# Altium schematic sheet ST-link V2.SchDoc
size A4; SheetNumber: 3; SheetTotal: 6
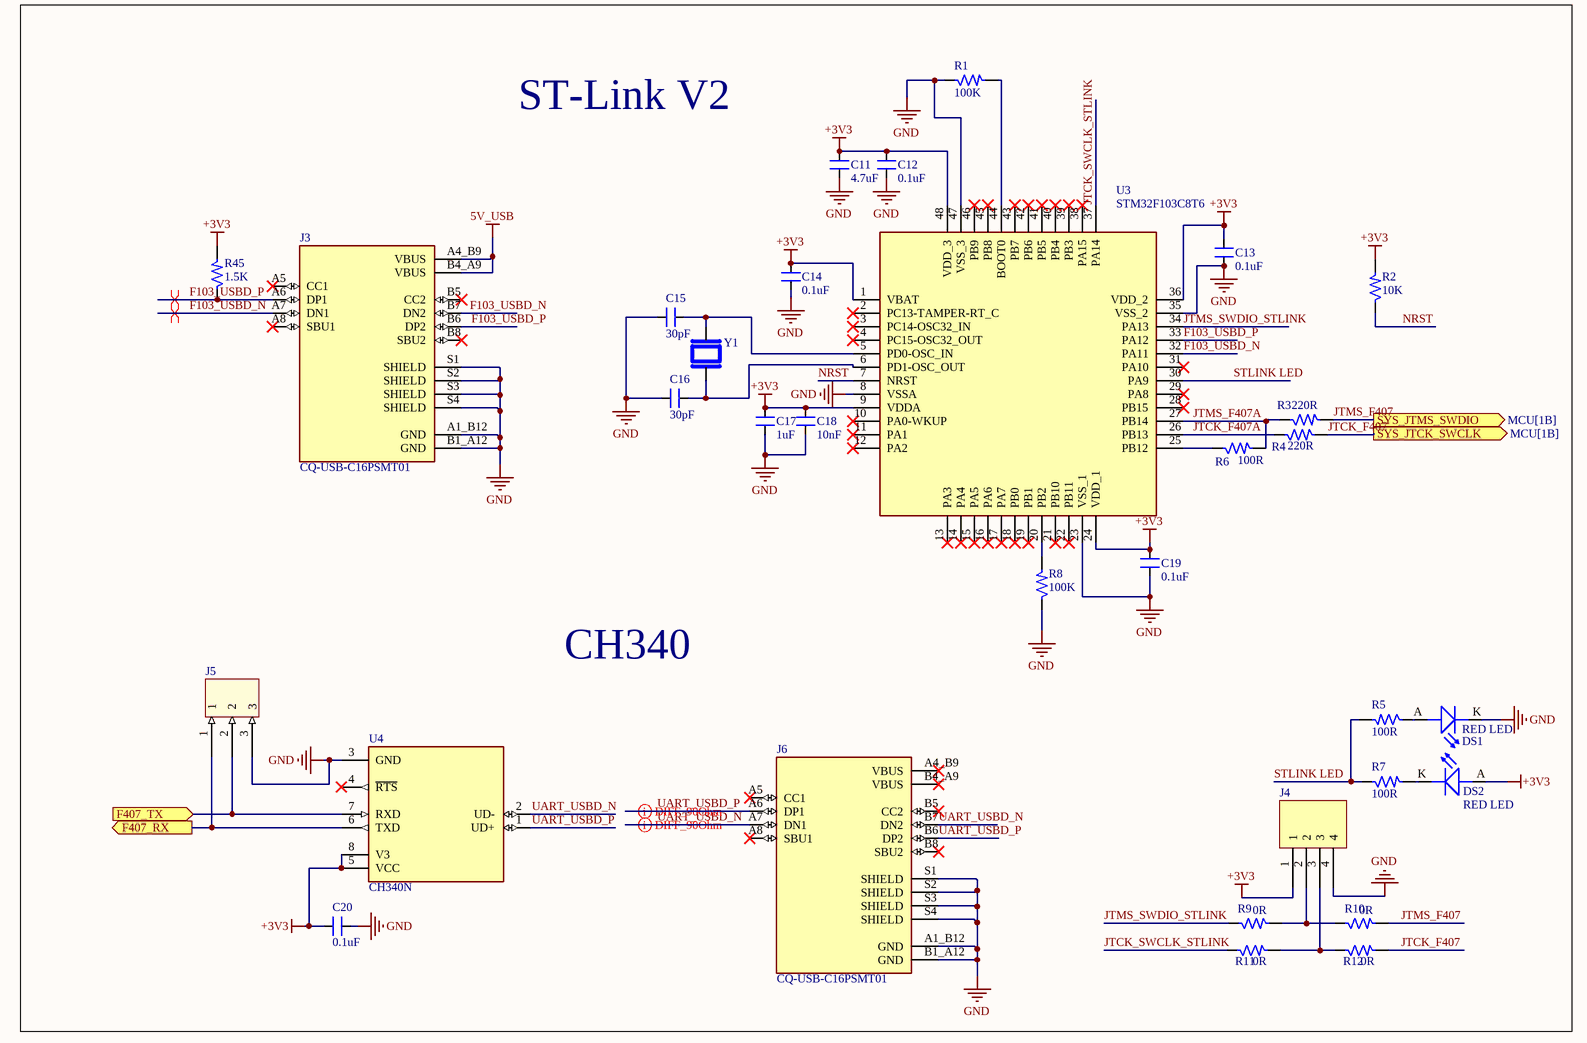
[diagram p0: ST-link V2.SchDoc]

## Parts
C11  4.7uF  [CAP_0805]
C12  0.1uF  [CAP_0805]
C13  0.1uF  [CAP_0805]
C14  0.1uF  [CAP_0805]
C15  30pF  [CAP_0805]
C16  30pF  [CAP_0805]
C17  1uF  [CAP_0805]
C18  10nF  [CAP_0805]
C19  0.1uF  [CAP_0805]
C20  0.1uF  [CAP_0805]
DS1  RED LED  [LED_0805]
DS2  RED LED  [LED_0805]
J3  CQ-USB-C16PSMT01  [SHENZHEN-CHUANGQIN-TECHNOLOGY_CQ-USB-C16PSMT01]
J4  4X1 BERG STRIP  [CON4_100_40D72_TH_ST_MALE]  (value not drawn)
J5  3X1 BERG STRIP  [CON3_100_40D72_TH_ST-MALE]  (value not drawn)
J6  CQ-USB-C16PSMT01  [SHENZHEN-CHUANGQIN-TECHNOLOGY_CQ-USB-C16PSMT01]
R1  100K  [RES_0603]
R2  10K  [RES_0603]
R3  220R  [RES_0805]
R4  220R  [RES_0805]
R5  100R  [RES_0805]
R6  100R  [RES_0805]
R7  100R  [RES_0805]
R8  100K  [RES_0603]
R9  0R  [RES_0805]
R10  0R  [RES_0805]
R11  0R  [RES_0805]
R12  0R  [RES_0805]
R45  1.5K  [RES_0805]
U3  STM32F103C8T6  [LQFP-48_19.6_393_58X11_SMD]
U4  CH340N  [SOIC127P600X160-8N]
Y1  ATS08A-E  [XTAL_HC49P488W43L1085T450H368]  (value not drawn)

## Ports
F407_RX (out, see MCU[1A]), F407_TX (in, see MCU[1A]), SYS_JTCK_SWCLK (out, see MCU[1B]), SYS_JTMS_SWDIO (out, see MCU[1B])

## Nets
5V_USB: J3.A4_B9(VBUS) J3.B4_A9(VBUS)
+3V3: C11.2 C12.2 C13.2 C14.2 C17.2 C18.2 C19.2 C20.2 DS2.A(ANODE) J4.1 R2.2 R45.2 U3.1(VBAT) U3.9(VDDA) U3.24(VDD_1) U3.36(VDD_2) U3.48(VDD_3) U4.5(VCC) U4.8(V3)
GND: C11.1 C12.1 C13.1 C14.1 C15.1 C16.1 C17.1 C18.1 C19.1 C20.1 DS1.K(CATHODE) J3.A1_B12(GND) J3.B1_A12(GND) J3.S1(SHIELD) J3.S2(SHIELD) J3.S3(SHIELD) J3.S4(SHIELD) J4.4 J5.3 J6.A1_B12(GND) J6.B1_A12(GND) J6.S1(SHIELD) J6.S2(SHIELD) J6.S3(SHIELD) J6.S4(SHIELD) R1.1 R8.1 U3.8(VSSA) U3.23(VSS_1) U3.35(VSS_2) U3.47(VSS_3) U4.3(GND)
F103_USBD_N: J3.A7(DN1) J3.B7(DN2) U3.32(PA11)
F103_USBD_P: J3.A6(DP1) J3.B6(DP2) R45.1 U3.33(PA12)
F407_RX: J5.1 U4.6(TXD) ; port F407_RX
F407_TX: J5.2 U4.7(RXD) ; port F407_TX
JTCK_F407: R4.2 R12.2 ; port SYS_JTCK_SWCLK
JTCK_F407A: R4.1 U3.26(PB13)
JTCK_SWCLK_STLINK: R11.1 U3.37(PA14)
JTMS_F407: R3.2 R10.2 ; port SYS_JTMS_SWDIO
JTMS_F407A: R3.1 R6.2 U3.27(PB14)
JTMS_SWDIO_STLINK: R9.1 U3.34(PA13)
NRST: R2.1 U3.7(NRST)
STLINK LED: R5.2 R7.1 U3.30(PA9)
UART_USBD_N: J6.A7(DN1) J6.B7(DN2) U4.2(UD-)
UART_USBD_P: J6.A6(DP1) J6.B6(DP2) U4.1(UD+)
NetC15_2: C15.2 U3.5(PD0-OSC_IN) Y1.2
NetC16_2: C16.2 U3.6(PD1-OSC_OUT) Y1.1
NetDS1_A: DS1.A(ANODE) R5.1
NetDS2_K: DS2.K(CATHODE) R7.2
NetJ4_2: J4.2 R9.2 R10.1
NetJ4_3: J4.3 R11.2 R12.1
NetR1_2: R1.2 U3.44(BOOT0)
NetR6_1: R6.1 U3.25(PB12)
NetR8_2: R8.2 U3.20(PB2)

Not connected (* = marked no-connect by the designer): J3 A5(CC1)* A8(SBU1)* B5(CC2)* B8(SBU2)*; J6 A4_B9(VBUS)* A5(CC1)* A8(SBU1)* B4_A9(VBUS)* B5(CC2)* B8(SBU2)*; U3 2(PC13-TAMPER-RT_C)* 3(PC14-OSC32_IN)* 4(PC15-OSC32_OUT)* 10(PA0-WKUP)* 11(PA1)* 12(PA2)* 13(PA3)* 14(PA4)* 15(PA5)* 16(PA6)* 17(PA7)* 18(PB0)* 19(PB1)* 21(PB10)* 22(PB11)* 28(PB15)* 29(PA8)* 31(PA10)* 38(PA15)* 39(PB3)* 40(PB4)* 41(PB5)* 42(PB6)* 43(PB7)* 45(PB8)* 46(PB9)*; U4 4(~{RTS})*

## Layout directives
differential pair: F103_USBD_N, F103_USBD_P, UART_USBD_N, UART_USBD_P

## Notes on the sheet
- ST-Link V2
- CH340

## Library data of the parts
C11 = CAP_4.7uF-50V-10%-0805: 4.7µF ±10% 50V Ceramic Capacitor X5R 0805 (2012 Metric); Manufacturer: Yageo; Manufacturer Part Number: GRM21BR61H475KE51L; Alternate Part Number-1: NA; Case/Package: 0805; Supplier-1: SIRICOM; Supplier Part Number-1: CL21A475KBQNNNE
C12-C14 C19 C20 = CAP_0.1uF-50V-10%-0805: 0.1µF ±10% 50V Ceramic Capacitor X7R 0805 (2012 Metric); Manufacturer: Samsung; Manufacturer Part Number: CL21B104KBCNNNC; Alternate Part Number-1: NA; Case/Package: 0805; Supplier-1: SIRICOM; Supplier Part Number-1: 0805B104K500CT
C15 C16 = CAP_30pF-50V-10%-0805: ±10% 50V Ceramic Capacitor C0G, NP0 0805 (2012 Metric); Manufacturer Part Number: C0805C300K5GAC7800; Manufacturer: KEMET; Alternate Part Number: NA; Case/Package: 0805; Supplier-1: Digikey; Supplier Part Number-1: 399-17443-1-ND - Cut Tape (CT)
C17 = CAP_1uF-50V-5%-0805: 1µF ±5% 50V Ceramic Capacitor X7R 0805 (2012 Metric); Manufacturer: Samsung; Manufacturer Part Number: CC0805JKX7R9BB105; Alternate Part Number-1: 0805F105M500NT; Case/Package: 0805; Supplier-1: SIRICOM; Supplier Part Number-1: CL21B105KBFNNNE
C18 = CAP_10nF-50V-10%-0805: 10000pF ±10% 50V Ceramic Capacitor X7R 0805 (2012 Metric); Manufacturer: Samsung; Manufacturer Part Number: C0805C103K5RECAUTO; Alternate Part Number-1: GRM2195C1H103JA01D; Case/Package: 0805; Supplier-1: SIRICOM; Supplier Part Number-1: 0805B103K500CT
DS1 DS2 = LED_RED-2V-20mA-0805: Red 631nm LED Indication - Discrete 2V 0805 (2012 Metric); Manufacturer: Vishay Lite-On; Manufacturer Part Number: LTST-C171KRKT; Alternate Part Number-1: NA; Case/Package: 0805; Supplier-1: SP ROAD; Supplier Part Number-1: LTST-C171KRKT
J3 J6 = CQ-USB-C16PSMT01: C Type USB Type-C Female Plug 16 Pin Connector Power Charger Jack Port; MF: Shenzen Chuangqin Technology; SnapEDA_Link: https://www.snapeda.com/parts/CQ-USB-C16PSMT01/Shenzen+Chuangqin+Technology/view-part/?ref=snap; Package: Package; Value: *; MP: CQ-USB-C16PSMT01; Check_prices: https://www.snapeda.com/parts/CQ-USB-C16PSMT01/Shenzen+Chuangqin+Technology/view-part/?ref=eda
J4 = CON-BS-PLG_4X1-100-ST-TH: 4 Pins, 1 Row 2.54mm Pitch, Straight bergstrip, Male; Manufacturer: NA; Manufacturer Part Number: NA; Case/Package: TH-CON; Supplier-1: SP ROAD; Supplier Part Number-1: NA; Alternate Part Number-1: NA
J5 = CON-BS-PLG_3X1-100-ST-TH: 3 Pins, 1 Row 2.54mm Pitch, Straight bergstrip, Male; Manufacturer: NA; Manufacturer Part Number: RKI-1140; Case/Package: TH-CON; Supplier-1: SP ROAD; Supplier Part Number-1: NA; Alternate Part Number-1: NA
R1 R8 = RES_100K-0.1W-1%-0603: 100 kOhms ±1% 0.1W, 1/10W Chip Resistor 0603 (1608 Metric) Automotive AEC-Q200 Thick Film; Manufacturer: Stackpole Electronics; Manufacturer Part Number: RMCF0603FT100K; Alternate Part Number-1: NA; Case/Package: 0603; Supplier-1: Arrow; Supplier Part Number-1: RMCF0603FT100K
R2 = RES_10K-0.1W-1%-0603: 10 kOhms ±1% 0.1W, 1/10W Chip Resistor 0603 (1608 Metric) Automotive AEC-Q200 Thick Film; Manufacturer: Walsin; Manufacturer Part Number: WR06X1002FTL; Alternate Part Number-1: 0603WAJ0103T5E; Case/Package: 0603; Supplier-1: SIRICOM; Supplier Part Number-1: WR06X1002FTL
R3 R4 = RES_220R-0.125W-1%-0805: 220 Ohms ±1% 0.125W, 1/8W Chip Resistor 0805 (2012 Metric) Automotive AEC-Q200 Thick Film; Manufacturer: Walsin; Manufacturer Part Number: WR08X2200FTL; Alternate Part Number-1: RS-05K2200FT; Case/Package: 0805; Supplier-1: SIRICOM; Supplier Part Number-1: WR08X2200FTL
R5-R7 = RES_100R-0.125W-1%-0805: 100 Ohms ±1% 0.125W, 1/8W Chip Resistor 0805 (2012 Metric) Automotive AEC-Q200, Pulse Withstanding Thick Film; Manufacturer: Walsin; Manufacturer Part Number: WR08X1000FTL; Case/Package: 0805; Supplier-1: SIRICOM; Supplier Part Number-1: WR08X1000FTL; Alternate Part Number-1: WR08X1000FTL
R9-R12 = RES_0R-0.125W-1%-0805: 0 Ohms Jumper 0.125W, 1/8W Chip Resistor 0805 (2012 Metric) Automotive AEC-Q200 Thick Film; Manufacturer: Walsin; Manufacturer Part Number: WR08X000PTL; Case/Package: 0805; Supplier-1: SIRICOM; Supplier Part Number-1: WR08X000PTL; Alternate Part Number-1: WR08X000PTL
R45 = RES_1.5K-0.125W-1%-0805: 1.5 kOhms ±1% 0.125W, 1/8W Chip Resistor 0805 (2012 Metric) Thick Film; Manufacturer: TE Connectivity Passive Product; Manufacturer Part Number: CRG0805F1K5; Alternate Part Number-1: NA; Case/Package: 0805; Supplier-1: SIRICOM; Supplier Part Number-1: NA
U3 = IC_STM32F103C8T6: ARM® Cortex®-M3 STM32F1 Microcontroller IC 32-Bit 72MHz 64KB (64K x 8) FLASH 48-LQFP (7x7); Manufacturer: STMicroelectronics; Alternate Part Number-1: NA; Manufacturer Part Number: STM32F103C8T6; Case/Package: LQFP48; Supplier-1: LCSC; Supplier Part Number-1: STM32F103C8T6
U4 = CH340N: USB to Serial Port Chip; MF: WCH; SnapEDA_Link: https://www.snapeda.com/parts/CH340N/WCH/view-part/?ref=snap; Package: Package; Value: *; MP: CH340N; Check_prices: https://www.snapeda.com/parts/CH340N/WCH/view-part/?ref=eda
Y1 = ATS08A-E: 8 MHz Â±30ppm Crystal 20pF 60 Ohms HC-49/US; MF: CTS; SnapEDA_Link: https://www.snapeda.com/parts/ATS08A-E/CTS+Components/view-part/?ref=snap; Package: HC-49/US CTS-Frequency Controls; Value: *; MP: ATS08A-E; Check_prices: https://www.snapeda.com/parts/ATS08A-E/CTS+Components/view-part/?ref=eda